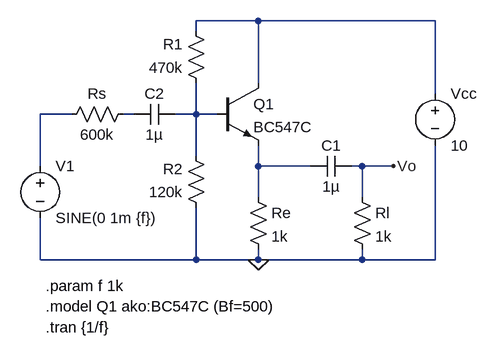
[diagram p0: schematic Circuito Colector Común.asc]
Circuito Colector Común.asc, the LTspice schematic file:
Version 4
SHEET 1 880 680
WIRE 416 -48 320 -48
WIRE 688 -48 416 -48
WIRE 320 -32 320 -48
WIRE 416 48 416 -48
WIRE 688 64 688 -48
WIRE 128 96 80 96
WIRE 224 96 208 96
WIRE 320 96 320 48
WIRE 320 96 288 96
WIRE 352 96 320 96
WIRE 320 160 320 96
WIRE 80 176 80 96
WIRE 416 176 416 144
WIRE 496 176 416 176
WIRE 576 176 560 176
WIRE 624 176 576 176
WIRE 416 224 416 176
WIRE 576 224 576 176
WIRE 80 320 80 256
WIRE 320 320 320 240
WIRE 320 320 80 320
WIRE 416 320 416 304
WIRE 416 320 320 320
WIRE 576 320 576 304
WIRE 576 320 416 320
WIRE 688 320 688 144
WIRE 688 320 576 320
FLAG 416 320 0
FLAG 624 176 Vo
SYMBOL voltage 80 160 R0
WINDOW 123 0 0 Left 0
WINDOW 39 0 0 Left 0
SYMATTR InstName V1
SYMATTR Value SINE(0 1m {f})
SYMBOL res 224 80 R90
WINDOW 0 0 56 VBottom 2
WINDOW 3 32 56 VTop 2
SYMATTR InstName Rs
SYMATTR Value 600k
SYMBOL res 336 256 R180
WINDOW 0 36 76 Left 2
WINDOW 3 36 40 Left 2
SYMATTR InstName R2
SYMATTR Value 120k
SYMBOL res 336 64 R180
WINDOW 0 36 76 Left 2
WINDOW 3 36 40 Left 2
SYMATTR InstName R1
SYMATTR Value 470k
SYMBOL res 400 208 R0
SYMATTR InstName Re
SYMATTR Value 1k
SYMBOL res 560 208 R0
SYMATTR InstName Rl
SYMATTR Value 1k
SYMBOL voltage 688 48 R0
WINDOW 123 0 0 Left 0
WINDOW 39 0 0 Left 0
SYMATTR InstName Vcc
SYMATTR Value 10
SYMBOL cap 560 160 R90
WINDOW 0 0 32 VBottom 2
WINDOW 3 32 32 VTop 2
SYMATTR InstName C1
SYMATTR Value 1µ
SYMBOL cap 288 80 R90
WINDOW 0 0 32 VBottom 2
WINDOW 3 32 32 VTop 2
SYMATTR InstName C2
SYMATTR Value 1µ
SYMBOL npn 352 48 R0
SYMATTR InstName Q1
SYMATTR Value BC547C
TEXT 88 360 Left 2 !.param f 1k
TEXT 88 424 Left 2 !.tran {1/f}
TEXT 88 392 Left 2 !.model Q1 ako:BC547C (Bf=500)

The netlist it stands for:
* Circuito Colector Común.asc
V1 N002 0 SINE(0 1m {f})
Rs N003 N002 600k
R2 0 N004 120k
R1 N004 N001 470k
Re N005 0 1k
Rl Vo 0 1k
Vcc N001 0 10
C1 Vo N005 1µ
C2 N004 N003 1µ
Q1 N001 N004 N005 0 BC547C
.model NPN NPN
.model PNP PNP
.lib standard.bjt
.param f 1k
.tran {1/f}
.model Q1 ako:BC547C (Bf=500)
.backanno
.end